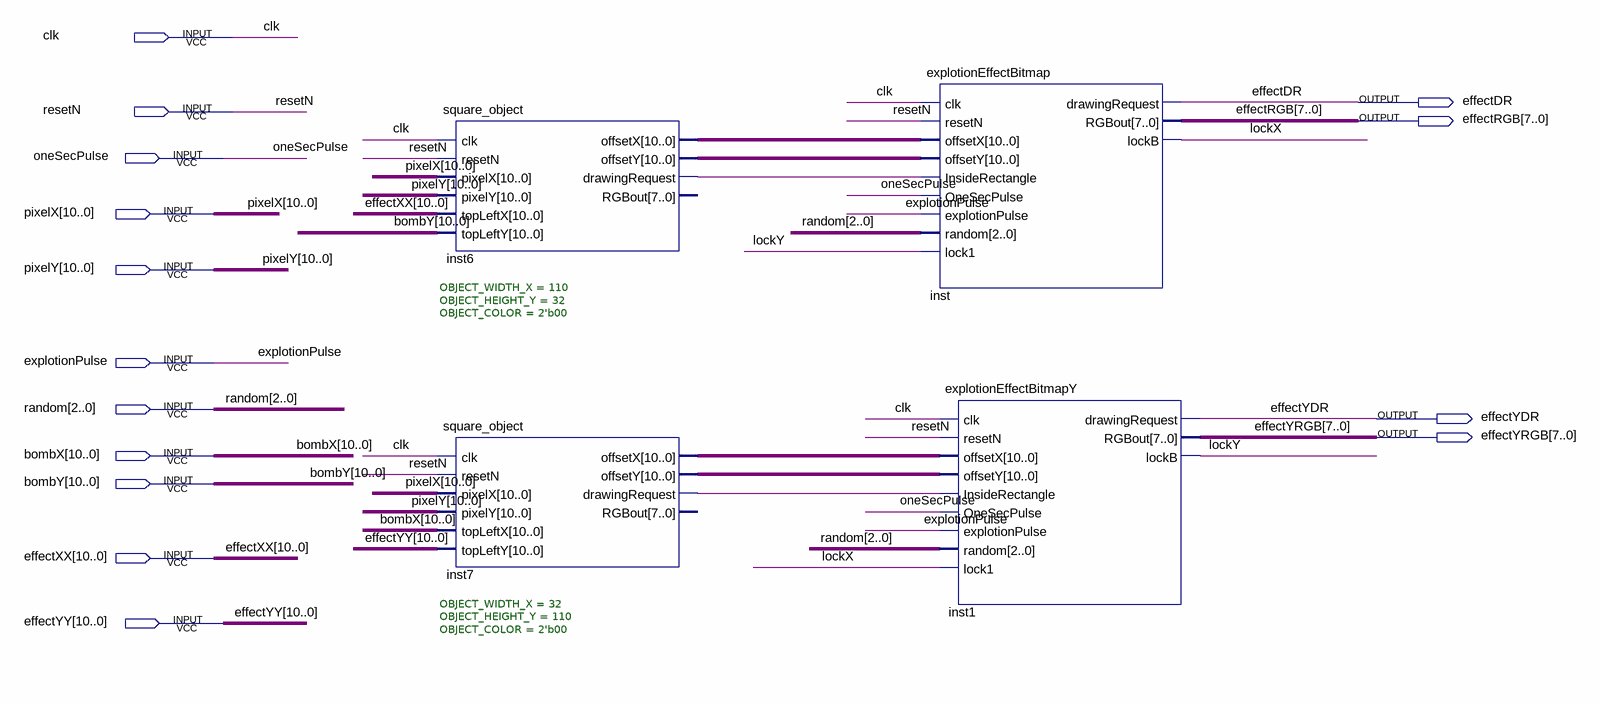
[diagram p0: schematic sheet]
// Quartus schematic explotionBlock_T.bdf as structural Verilog: 4 symbols, 15 pins
module explotionBlock_T (
  input  clk,
  input  resetN,
  input  oneSecPulse,
  input  [10:0] pixelX,
  input  [10:0] pixelY,
  input  explotionPulse,
  input  [2:0] random,
  input  [10:0] bombX,
  input  [10:0] bombY,
  input  [10:0] effectXX,
  input  [10:0] effectYY,
  output effectDR,
  output [7:0] effectRGB,
  output effectYDR,
  output [7:0] effectYRGB
);

  wire inst6_drawingrequest, inst7_drawingrequest, lockX, lockY;
  wire [10:0] inst6_offsetx, inst6_offsety, inst7_offsetx, inst7_offsety;

  square_object #(.OBJECT_WIDTH_X(110), .OBJECT_HEIGHT_Y(32), .OBJECT_COLOR(2'b00)) inst6 (
    .clk(clk), .resetN(resetN), .pixelX(pixelX), .pixelY(pixelY), .topLeftX(effectXX), .topLeftY(bombY),
    .offsetX(inst6_offsetx), .offsetY(inst6_offsety), .drawingRequest(inst6_drawingrequest));  // open: RGBout
  square_object #(.OBJECT_WIDTH_X(32), .OBJECT_HEIGHT_Y(110), .OBJECT_COLOR(2'b00)) inst7 (
    .clk(clk), .resetN(resetN), .pixelX(pixelX), .pixelY(pixelY), .topLeftX(bombX), .topLeftY(effectYY),
    .offsetX(inst7_offsetx), .offsetY(inst7_offsety), .drawingRequest(inst7_drawingrequest));  // open: RGBout
  explotionEffectBitmap inst (
    .clk(clk), .resetN(resetN), .offsetX(inst6_offsetx), .offsetY(inst6_offsety),
    .InsideRectangle(inst6_drawingrequest), .OneSecPulse(oneSecPulse), .explotionPulse(explotionPulse),
    .random(random), .lock1(lockY), .drawingRequest(effectDR), .RGBout(effectRGB), .lockB(lockX));
  explotionEffectBitmapY inst1 (
    .clk(clk), .resetN(resetN), .offsetX(inst7_offsetx), .offsetY(inst7_offsety),
    .InsideRectangle(inst7_drawingrequest), .OneSecPulse(oneSecPulse), .explotionPulse(explotionPulse),
    .random(random), .lock1(lockX), .drawingRequest(effectYDR), .RGBout(effectYRGB), .lockB(lockY));
endmodule
